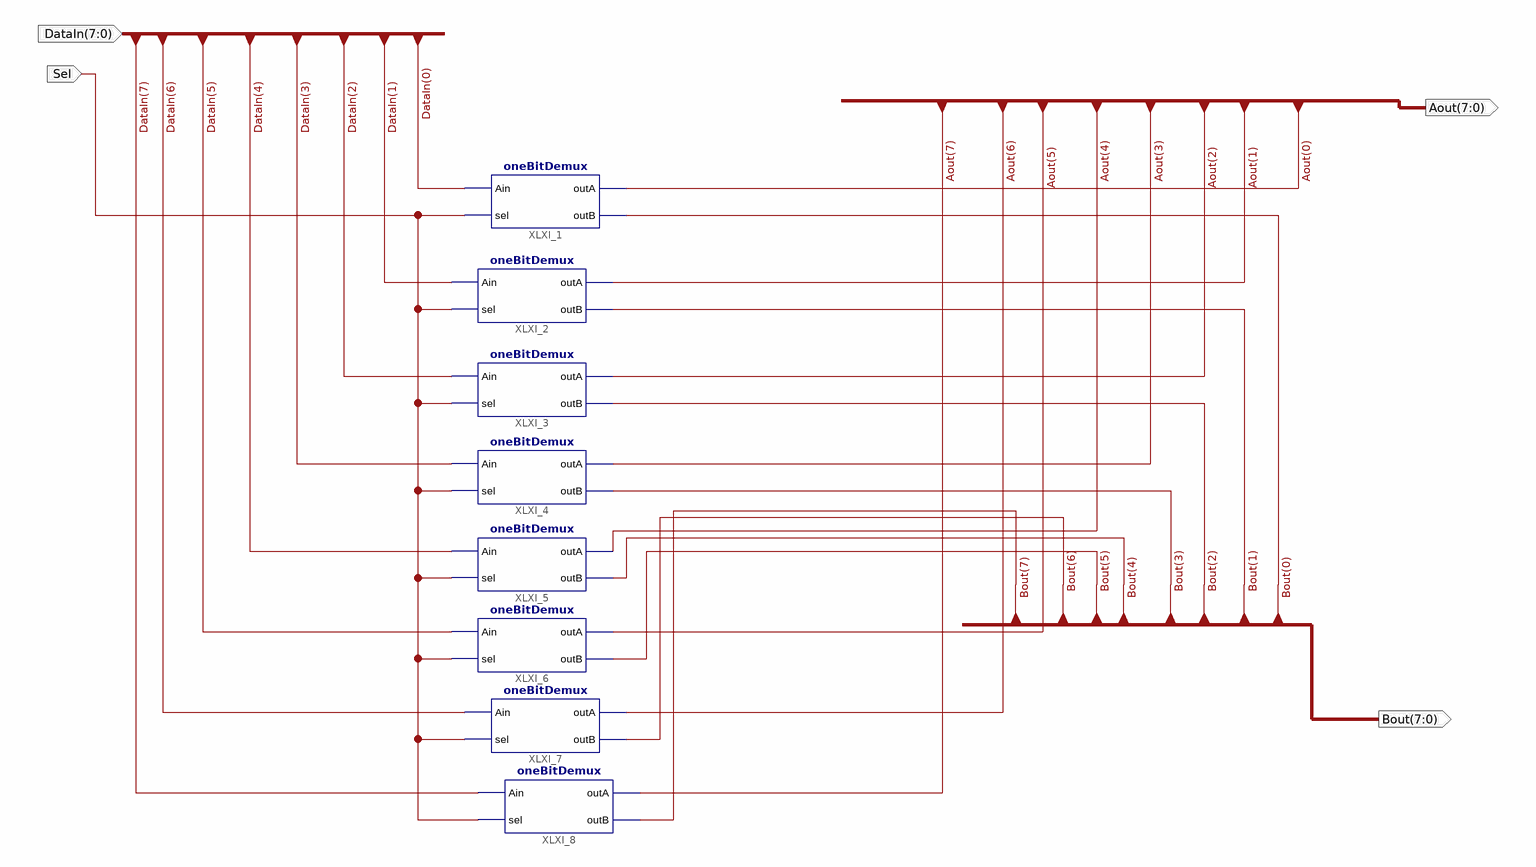
[diagram p0: schematic sheet 1]
// Xilinx ISE schematic Demux8bit.sch (spartan3e) as structural Verilog: 8 symbols, 4 ports
module Demux8bit (
  input  [7:0] DataIn,
  input  Sel,
  output [7:0] Aout,
  output [7:0] Bout
);

  oneBitDemux XLXI_1 (.Ain(DataIn[0]), .sel(Sel), .outA(Aout[0]), .outB(Bout[0]));
  oneBitDemux XLXI_2 (.Ain(DataIn[1]), .sel(Sel), .outA(Aout[1]), .outB(Bout[1]));
  oneBitDemux XLXI_3 (.Ain(DataIn[2]), .sel(Sel), .outA(Aout[2]), .outB(Bout[2]));
  oneBitDemux XLXI_4 (.Ain(DataIn[3]), .sel(Sel), .outA(Aout[3]), .outB(Bout[3]));
  oneBitDemux XLXI_5 (.Ain(DataIn[4]), .sel(Sel), .outA(Aout[4]), .outB(Bout[4]));
  oneBitDemux XLXI_6 (.Ain(DataIn[5]), .sel(Sel), .outA(Aout[5]), .outB(Bout[5]));
  oneBitDemux XLXI_7 (.Ain(DataIn[6]), .sel(Sel), .outA(Aout[6]), .outB(Bout[6]));
  oneBitDemux XLXI_8 (.Ain(DataIn[7]), .sel(Sel), .outA(Aout[7]), .outB(Bout[7]));
endmodule
